# Altium project Driver Relé.PrjPcb
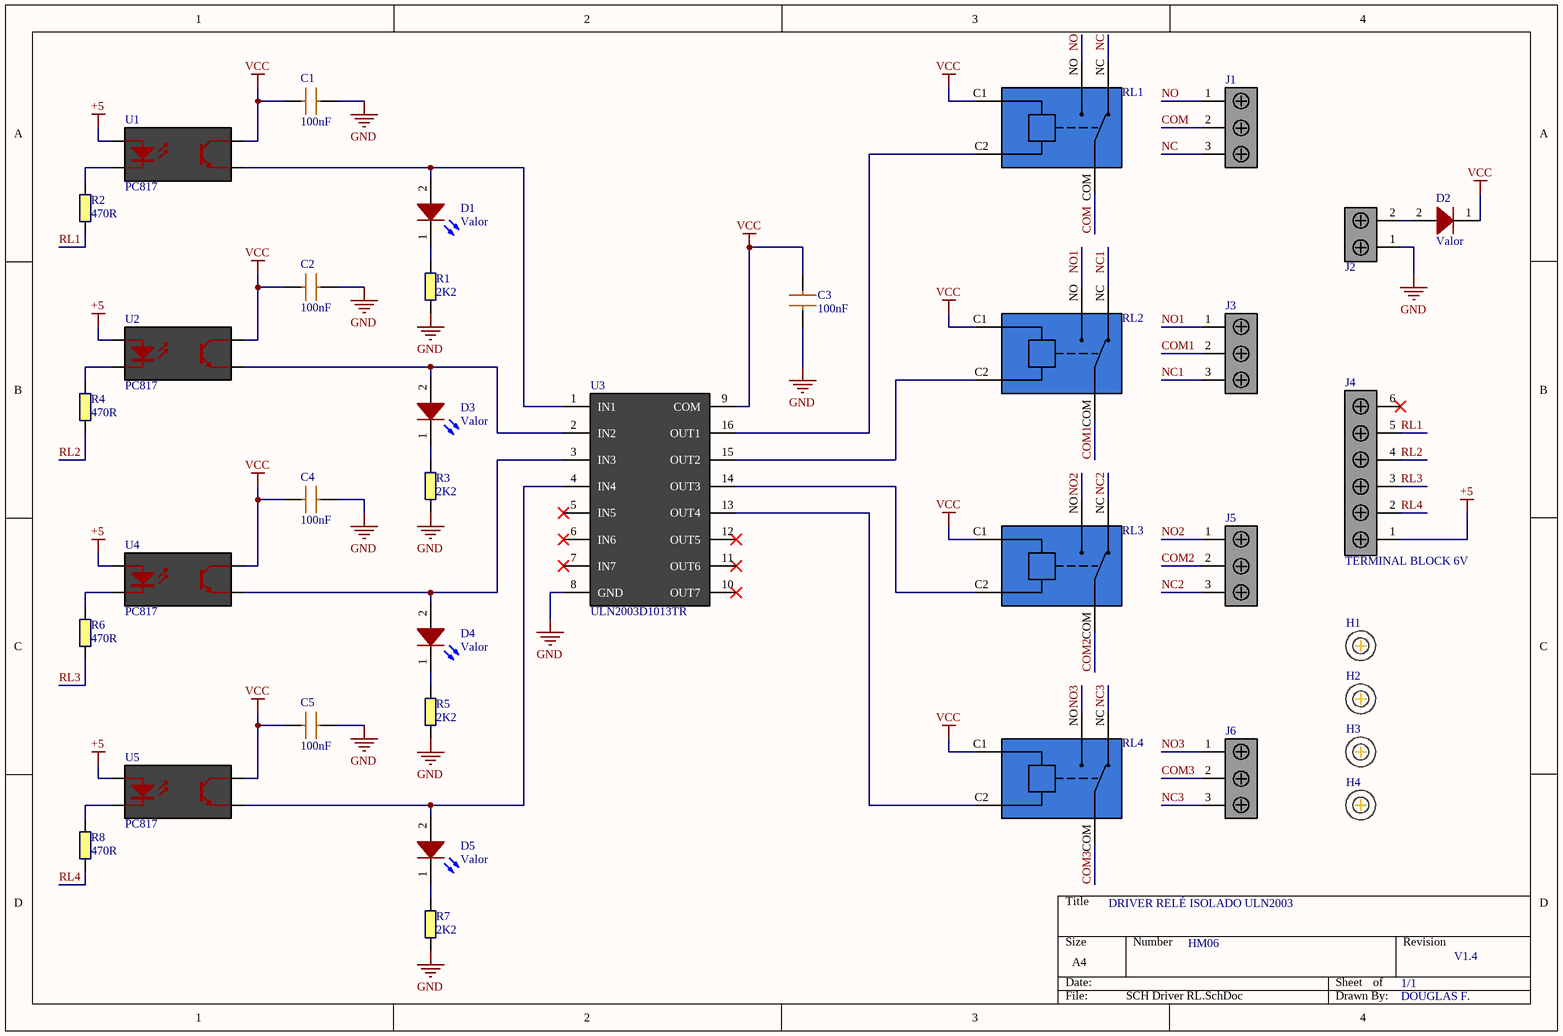
[diagram p0: SCH Driver RL.SchDoc]
1 sheet, 37 parts. Net scope: global (net labels, ports and power ports of the same name join across sheets).
Board file: LYT Driver.PcbDoc

## Sheet SCH Driver RL.SchDoc
size A4; SheetNumber: 1; SheetTotal: 1

### Parts
C1  100nF  [RAD-0.2]
C2  100nF  [RAD-0.2]
C3  100nF  [RAD-0.2]
C4  100nF  [RAD-0.2]
C5  100nF  [RAD-0.2]
D1  Valor  [LED 3MM]
D2  Valor  [1N4007 DO-41]
D3  Valor  [LED 3MM]
D4  Valor  [LED 3MM]
D5  Valor  [LED 3MM]
H1  M3  [Parafuso M3]  (value not drawn)
H2  M3  [Parafuso M3]  (value not drawn)
H3  M3  [Parafuso M3]  (value not drawn)
H4  M3  [Parafuso M3]  (value not drawn)
J1  Conector 2v Phoenix  [Terminal block 5mm 3V]  (value not drawn)
J2  Conector 2v Phoenix  [Terminal block 5mm 2V]  (value not drawn)
J3  Conector 2v Phoenix  [Terminal block 5mm 3V]  (value not drawn)
J4  TERMINAL BLOCK 6V  [Terminal block 5mm 6V]
J5  Conector 2v Phoenix  [Terminal block 5mm 3V]  (value not drawn)
J6  Conector 2v Phoenix  [Terminal block 5mm 3V]  (value not drawn)
R1  2K2  [RES 1/4 PTH]
R2  470R  [RES 1/4 PTH]
R3  2K2  [RES 1/4 PTH]
R4  470R  [RES 1/4 PTH]
R5  2K2  [RES 1/4 PTH]
R6  470R  [RES 1/4 PTH]
R7  2K2  [RES 1/4 PTH]
R8  470R  [RES 1/4 PTH]
RL1  Relé 12v 5p  [RELAY]  (value not drawn)
RL2  Relé 12v 5p  [RELAY]  (value not drawn)
RL3  Relé 12v 5p  [RELAY]  (value not drawn)
RL4  Relé 12v 5p  [RELAY]  (value not drawn)
U1  PC817  [PC817 DIP-4]
U2  PC817  [PC817 DIP-4]
U3  ULN2003D1013TR  [PDIP-16]
U4  PC817  [PC817 DIP-4]
U5  PC817  [PC817 DIP-4]

### Nets
+5: J4.1 U1.1(A) U2.1(A) U4.1(A) U5.1(A)
GND: C1.1 C2.1 C3.1 C4.1 C5.1 J2.1 R1.2 R3.2 R5.2 R7.2 U3.8(GND)
VCC: C1.2 C2.2 C3.2 C4.2 C5.2 D2.1 RL1.C1(COIL_1) RL2.C1(COIL_1) RL3.C1(COIL_1) RL4.C1(COIL_1) U1.4(C) U2.4(C) U3.9(COM) U4.4(C) U5.4(C)
COM: J1.2 RL1.COM
COM1: J3.2 RL2.COM
COM2: J5.2 RL3.COM
COM3: J6.2 RL4.COM
NC: J1.3 RL1.NC
NC1: J3.3 RL2.NC
NC2: J5.3 RL3.NC
NC3: J6.3 RL4.NC
NO: J1.1 RL1.NO
NO1: J3.1 RL2.NO
NO2: J5.1 RL3.NO
NO3: J6.1 RL4.NO
RL1: J4.5 R2.1
RL2: J4.4 R4.1
RL3: J4.3 R6.1
RL4: J4.2 R8.1
NetD1_1: D1.1 R1.1
NetD1_2: D1.2 U1.3(E) U3.1(IN1)
NetD2_2: D2.2 J2.2
NetD3_1: D3.1 R3.1
NetD3_2: D3.2 U2.3(E) U3.2(IN2)
NetD4_1: D4.1 R5.1
NetD4_2: D4.2 U3.3(IN3) U4.3(E)
NetD5_1: D5.1 R7.1
NetD5_2: D5.2 U3.4(IN4) U5.3(E)
NetR2_2: R2.2 U1.2(K)
NetR4_2: R4.2 U2.2(K)
NetR6_2: R6.2 U4.2(K)
NetR8_2: R8.2 U5.2(K)
NetRL1_C2: RL1.C2(COIL_2) U3.16(OUT1)
NetRL2_C2: RL2.C2(COIL_2) U3.15(OUT2)
NetRL3_C2: RL3.C2(COIL_2) U3.14(OUT3)
NetRL4_C2: RL4.C2(COIL_2) U3.13(OUT4)

Not connected (* = marked no-connect by the designer): J4 6*; U3 5(IN5)* 6(IN6)* 7(IN7)* 10(OUT7)* 11(OUT6)* 12(OUT5)*

### Notes on the sheet
- DRIVER RELÉ ISOLADO ULN2003
- HM06
- 1/1
- V1.4
- DOUGLAS F.

### Library data of the parts
C1-C5 = CAPACITOR: Published: 8-Jun-2000; LatestRevisionDate: 17-Jul-2002; LatestRevisionNote: Re-released for DXP Platform.; PackageReference: RAD-0.3; Publisher: Altium Limited; PackageDescription: Radial Cap, Thru-Hole; 2 Leads; 0.3 in Pin Spacing
D1 D3-D5 = LED: Typical RED, GREEN, YELLOW, AMBER GaAs LED; Published: 8-Jun-2000; LatestRevisionDate: 17-Jul-2002; LatestRevisionNote: Re-released for DXP Platform.; PackageVersion: Feb-2002; PackageReference: 3.2X1.6X1.1; Publisher: Altium Limited; PackageDescription: SM LED; 2 Flat Leads
D2 = DIODO 1N4007: Diodo rapido; Published: 8-Jun-2000; LatestRevisionDate: 17-Jul-2002; LatestRevisionNote: Re-released for DXP Platform.; DatasheetVersion: 1997; PackageReference: DO-35; Publisher: Altium Limited; PackageDescription: Diode, Axial; Body 3.8 x 1.9 mm (LxDia. max), Lead Dia. 0.53 mm (max); Code_JEDEC: DO-204-AH; ComponentLink1Description: Manufacturer Link; ComponentLink1URL: http://www.fairchildsemi.com/; ComponentLink2Description: Datasheet; ComponentLink2URL: http://www.fairchildsemi.com/ds/1N%2F1N4148.pdf
H1-H4 = Furo M3
J1 J3 J5 J6 = TERMINAL BLOCK 3V: Block, Terminal; 6 A; 63 V; 5 mm; 26 to 20 AWG; 3; Screw; Soldering; 1.5 kV; Manufacturer: Phoenix Contact; Manufacturer Part Number: 1725656; Current Rating: 6A; Voltage Rating: 125V; Number of Positions: 2; Number of Levels: 1; Connector Type: Screw,PCB,Terminal Block; Max Supply Voltage: 63V; Pitch: 2.54mm; Wire Gauge (Max): 26AWG; Wire Gauge (Min): 20AWG; Stripping Length: 4.5mm; Approvals: UL,CSA,cULus,EAC; RoHS: Yes; Category: Terminal Blocks; Stock 1: 29866; Pricing 1: 1=1,94000, 10=1,76000, 50=1,69000, 100=1,64000, 1000=1,27000, 10000=1,17000 (USD); Mount: Through Hole; Number of Pins: 2; Contact Material: Tin; Weight: 0.022575oz; Housing Material: Polyamide; Color: Green; Housing Color: Green; Insulation Material: Nylon; Package Quantity: 50; Packaging: Bulk; Termination: Solder; Series: MPT; Max Current Rating: 6A; Number of Contacts: 2; Number of Rows: 1; Number of Positions Per Level: 2; Current: 6A; Voltage: 125V; Orientation: Straight; Number of Poles: 2; Number of Circuits: 2; Length: 5.54mm; Width: 12mm; Height: 6.2mm; Depth: 6.2mm; Wire/Cable Gauge: 26AWG; Radiation Hardening: No; RoHS Compliant: Yes; Lead Free: Lead Free; Flammability Rating: UL94 V-0; Reach SVHC Compliant: Yes; ComponentLink1URL: https://datasheet.ciiva.com/16071/1725656-16071846.pdf?src-supplier=Onlinecomponents.com; ComponentLink1Description: https://datasheet.ciiva.com/16071/1725656-16071846.pdf?src-supplier=Onlinecomponents.com; ComponentLink2URL: https://datasheet.ciiva.com/15169/getdatasheetpartid-199323-15169849.pdf?src-supplier=Verical; ComponentLink2Description: https://datasheet.ciiva.com/15169/getdatasheetpartid-199323-15169849.pdf?src-supplier=Verical; ComponentLink3URL: https://datasheet.ciiva.com/823/1725656-823793.pdf?src-supplier=Digi-Key; ComponentLink3Description: https://datasheet.ciiva.com/823/1725656-823793.pdf?src-supplier=Digi-Key; ComponentLink4URL: https://datasheet.ciiva.com/1120/319957-1120510.pdf?src-supplier=Farnell; ComponentLink4Description: https://datasheet.ciiva.com/1120/319957-1120510.pdf?src-supplier=Farnell; ComponentLink5URL: https://datasheet.ciiva.com/26340/788052-da-01-en-100ntklemme-1725656-250-st-26340907.pdf?src-supplier=Conrad; ComponentLink5Description: https://datasheet.ciiva.com/26340/788052-da-01-en-100ntklemme-1725656-250-st-26340907.pdf?src-supplier=Conrad; Supplier Part Number 1: 651-1725656
J2 = TERMINAL BLOCK 2V: Block, Terminal; 6 A; 63 V; 5 mm; 26 to 20 AWG; 2; Screw; Soldering; 1.5 kV; Manufacturer: Phoenix Contact; Manufacturer Part Number: 1725656; Current Rating: 6A; Voltage Rating: 125V; Number of Positions: 2; Number of Levels: 1; Connector Type: Screw,PCB,Terminal Block; Max Supply Voltage: 63V; Pitch: 2.54mm; Wire Gauge (Max): 26AWG; Wire Gauge (Min): 20AWG; Stripping Length: 4.5mm; Approvals: UL,CSA,cULus,EAC; RoHS: Yes; Category: Terminal Blocks; Stock 1: 29866; Pricing 1: 1=1,94000, 10=1,76000, 50=1,69000, 100=1,64000, 1000=1,27000, 10000=1,17000 (USD); Mount: Through Hole; Number of Pins: 2; Contact Material: Tin; Weight: 0.022575oz; Housing Material: Polyamide; Color: Green; Housing Color: Green; Insulation Material: Nylon; Package Quantity: 50; Packaging: Bulk; Termination: Solder; Series: MPT; Max Current Rating: 6A; Number of Contacts: 2; Number of Rows: 1; Number of Positions Per Level: 2; Current: 6A; Voltage: 125V; Orientation: Straight; Number of Poles: 2; Number of Circuits: 2; Length: 5.54mm; Width: 12mm; Height: 6.2mm; Depth: 6.2mm; Wire/Cable Gauge: 26AWG; Radiation Hardening: No; RoHS Compliant: Yes; Lead Free: Lead Free; Flammability Rating: UL94 V-0; Reach SVHC Compliant: Yes; ComponentLink1URL: https://datasheet.ciiva.com/16071/1725656-16071846.pdf?src-supplier=Onlinecomponents.com; ComponentLink1Description: https://datasheet.ciiva.com/16071/1725656-16071846.pdf?src-supplier=Onlinecomponents.com; ComponentLink2URL: https://datasheet.ciiva.com/15169/getdatasheetpartid-199323-15169849.pdf?src-supplier=Verical; ComponentLink2Description: https://datasheet.ciiva.com/15169/getdatasheetpartid-199323-15169849.pdf?src-supplier=Verical; ComponentLink3URL: https://datasheet.ciiva.com/823/1725656-823793.pdf?src-supplier=Digi-Key; ComponentLink3Description: https://datasheet.ciiva.com/823/1725656-823793.pdf?src-supplier=Digi-Key; ComponentLink4URL: https://datasheet.ciiva.com/1120/319957-1120510.pdf?src-supplier=Farnell; ComponentLink4Description: https://datasheet.ciiva.com/1120/319957-1120510.pdf?src-supplier=Farnell; ComponentLink5URL: https://datasheet.ciiva.com/26340/788052-da-01-en-100ntklemme-1725656-250-st-26340907.pdf?src-supplier=Conrad; ComponentLink5Description: https://datasheet.ciiva.com/26340/788052-da-01-en-100ntklemme-1725656-250-st-26340907.pdf?src-supplier=Conrad; Supplier Part Number 1: 651-1725656
J4 = TERMINAL BLOCK 6V: Block, Terminal; 6 A; 63 V; 5 mm; 26 to 20 AWG; 6 Screw; Soldering; 1.5 kV
R1-R8 = RESISTOR 1/4W: Resistor; Published: 8-Jun-2000; LatestRevisionDate: 17-Jul-2002; LatestRevisionNote: Re-released for DXP Platform.; PackageReference: AXIAL-0.4; Publisher: Altium Limited; PackageDescription: Axial Device, Thru-Hole; 2 Leads; 0.4 in Pin Spacing
U3 = ULN2003D1013TR: ULN Series 50V 500 mA High Voltage High Current Seven Darlington Array - SOIC-16; Manufacturer: STMicroelectronics; Max Collector Current: 500mA; Collector Emitter Saturation Voltage: 1.1V; Number of Elements: 7; Collector-emitter Voltage-Max: 1.6V; Polarity: NPN; Manufacturer Part Number: ULN2003D1013TR; RoHS: Yes; Category: BJTs; Stock 1: 88835; Pricing 1: 1=0,77000, 10=0,67600, 50=0,67600, 100=0,51800, 1000=0,32800, 10000=0,30800 (USD); Mount: Surface Mount; Case/Package: SO; Number of Pins: 16; Weight: 0.007079oz; Contact Plating: Gold; Min Operating Temperature: -40°C; Max Operating Temperature: 85°C; Package Quantity: 1; Packaging: Tape and Reel; Collector Emitter Voltage (VCEO): 50V; Series: -; Collector Emitter Breakdown Voltage: 50V; Max Breakdown Voltage: 50V; Output Current: 500mA; Output Voltage: 50V; Voltage Rating (DC): 50V; Current Rating: 500mA; Length: 10mm; Width: 4mm; Height: 1.65mm; Radiation Hardening: No; Lead Free: Lead Free; RoHS Compliant: Yes; Reach SVHC Compliant: Yes; ComponentLink1URL: https://datasheet.ciiva.com/1193/1690348-1193460.pdf?src-supplier=Element14; ComponentLink1Description: https://datasheet.ciiva.com/1193/1690348-1193460.pdf?src-supplier=Element14; ComponentLink2URL: https://datasheet.ciiva.com/27056/2004591-27056027.pdf?src-supplier=Jameco; ComponentLink2Description: https://datasheet.ciiva.com/27056/2004591-27056027.pdf?src-supplier=Jameco; ComponentLink3URL: https://datasheet.ciiva.com/15139/getdatasheetpartid-40506-15139848.pdf?src-supplier=Verical; ComponentLink3Description: https://datasheet.ciiva.com/15139/getdatasheetpartid-40506-15139848.pdf?src-supplier=Verical; ComponentLink4URL: https://datasheet.ciiva.com/22696/1690348-22696618.pdf?src-supplier=Element14; ComponentLink4Description: https://datasheet.ciiva.com/22696/1690348-22696618.pdf?src-supplier=Element14; ComponentLink5URL: https://datasheet.ciiva.com/22635/1690348-22635247.pdf?src-supplier=Element14; ComponentLink5Description: https://datasheet.ciiva.com/22635/1690348-22635247.pdf?src-supplier=Element14; ComponentLink6URL: https://datasheet.ciiva.com/1700/cd00001244-1700815.pdf?src-supplier=Digi-Key; ComponentLink6Description: https://datasheet.ciiva.com/1700/cd00001244-1700815.pdf?src-supplier=Digi-Key; ComponentLink7URL: https://datasheet.ciiva.com/1700/cd00001244-1700814.pdf?src-supplier=Digi-Key; ComponentLink7Description: https://datasheet.ciiva.com/1700/cd00001244-1700814.pdf?src-supplier=Digi-Key; ComponentLink8URL: https://datasheet.ciiva.com/1700/cd00001244-1700816.pdf?src-supplier=Digi-Key; ComponentLink8Description: https://datasheet.ciiva.com/1700/cd00001244-1700816.pdf?src-supplier=Digi-Key; ComponentLink9URL: https://datasheet.ciiva.com/4459/cd00001244-4459145.pdf?src-supplier=Mouser; ComponentLink9Description: https://datasheet.ciiva.com/4459/cd00001244-4459145.pdf?src-supplier=Mouser; Supplier Part Number 1: 511-ULN2003D1013TR